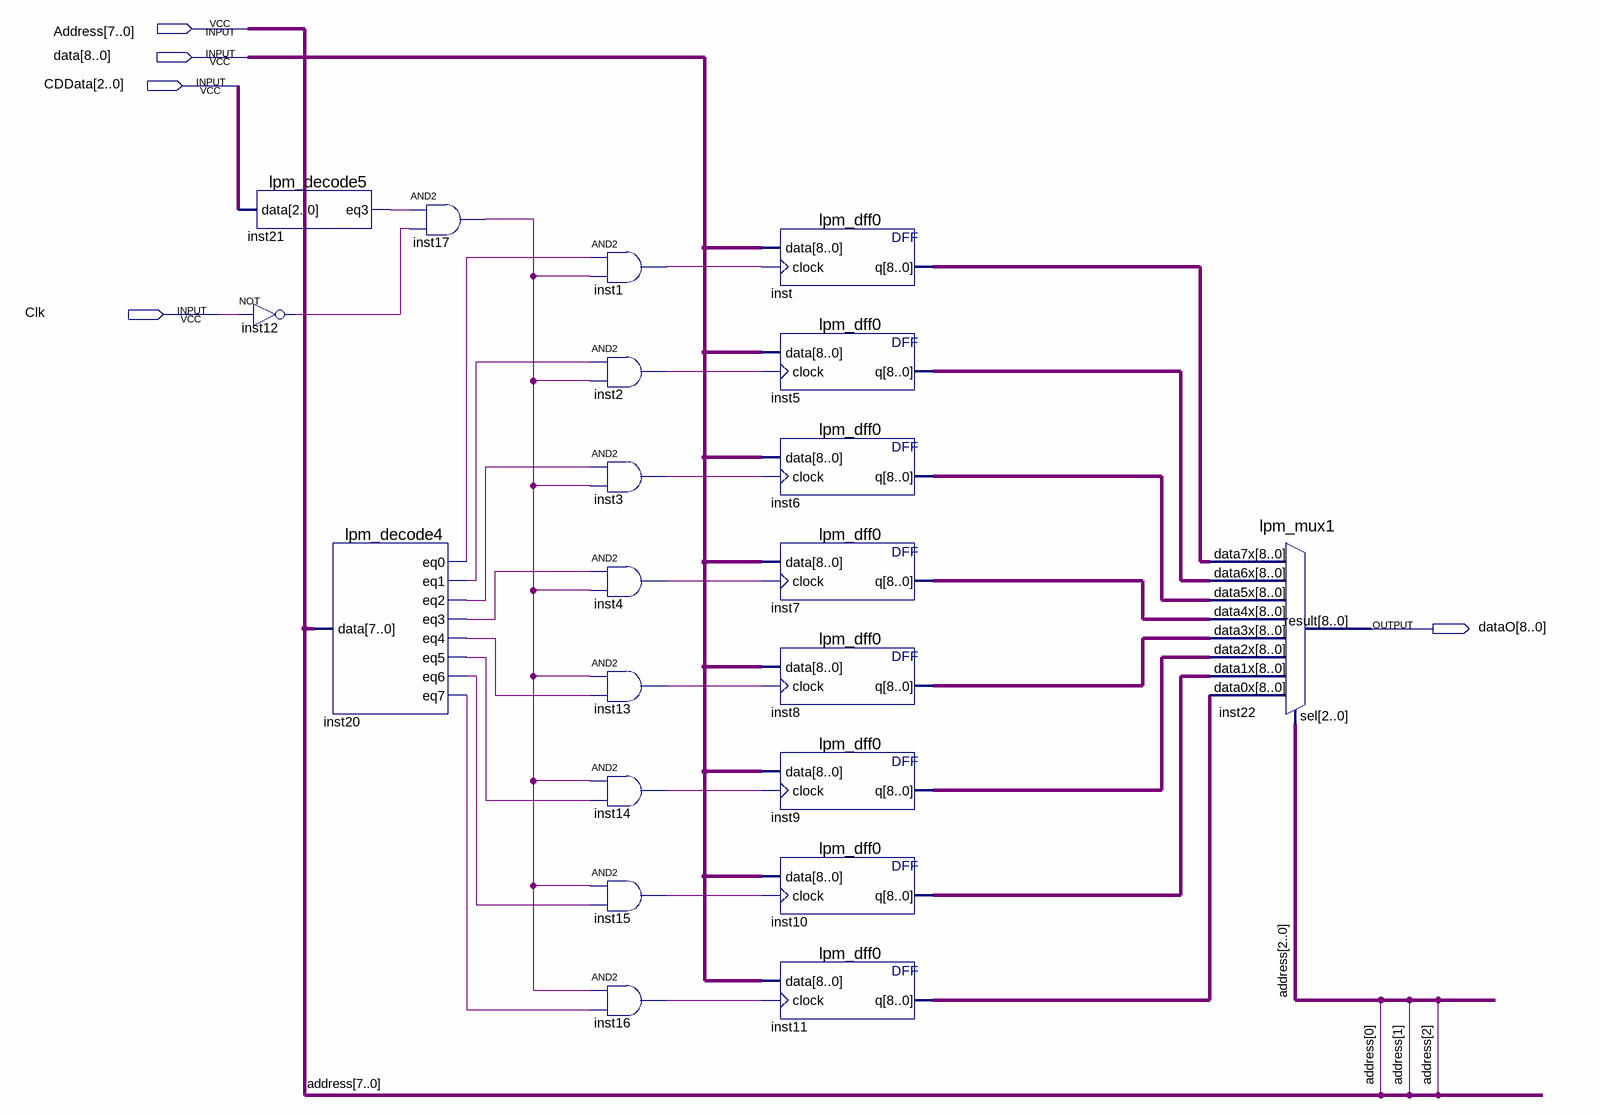
[diagram p0: schematic sheet]
// Quartus schematic RON.bdf as structural Verilog: 21 symbols, 5 pins
module RON (
  input  [7:0] Address,
  input  [8:0] data,
  input  [2:0] CDData,
  input  Clk,
  output [8:0] dataO
);

  wire inst1_out, inst2_out, inst3_out, inst4_out, inst12_out, inst13_out, inst14_out, inst15_out,
       inst16_out, inst17_out, inst20_eq0, inst20_eq1, inst20_eq2, inst20_eq3, inst20_eq4, inst20_eq5,
       inst20_eq6, inst20_eq7, inst21_eq3;
  wire [8:0] inst5_q, inst6_q, inst7_q, inst8_q, inst9_q, inst10_q, inst11_q, inst_q;

  lpm_decode5 inst21 (.data(CDData), .eq3(inst21_eq3));
  not inst12 (inst12_out, Clk);
  lpm_decode4 inst20 (
    .data(Address), .eq0(inst20_eq0), .eq1(inst20_eq1), .eq2(inst20_eq2), .eq3(inst20_eq3), .eq4(inst20_eq4),
    .eq5(inst20_eq5), .eq6(inst20_eq6), .eq7(inst20_eq7));
  and inst17 (inst17_out, inst21_eq3, inst12_out);
  and inst1 (inst1_out, inst20_eq0, inst17_out);
  and inst2 (inst2_out, inst20_eq1, inst17_out);
  and inst3 (inst3_out, inst20_eq2, inst17_out);
  and inst4 (inst4_out, inst20_eq3, inst17_out);
  and inst13 (inst13_out, inst17_out, inst20_eq4);
  and inst14 (inst14_out, inst17_out, inst20_eq5);
  and inst15 (inst15_out, inst17_out, inst20_eq6);
  and inst16 (inst16_out, inst17_out, inst20_eq7);
  lpm_dff0 inst (.data(data), .clock(inst1_out), .q(inst_q));
  lpm_dff0 inst5 (.data(data), .clock(inst2_out), .q(inst5_q));
  lpm_dff0 inst6 (.data(data), .clock(inst3_out), .q(inst6_q));
  lpm_dff0 inst7 (.data(data), .clock(inst4_out), .q(inst7_q));
  lpm_dff0 inst8 (.data(data), .clock(inst13_out), .q(inst8_q));
  lpm_dff0 inst9 (.data(data), .clock(inst14_out), .q(inst9_q));
  lpm_dff0 inst10 (.data(data), .clock(inst15_out), .q(inst10_q));
  lpm_dff0 inst11 (.data(data), .clock(inst16_out), .q(inst11_q));
  lpm_mux1 inst22 (
    .data7x(inst_q), .data6x(inst5_q), .data5x(inst6_q), .data4x(inst7_q), .data3x(inst8_q),
    .data2x(inst9_q), .data1x(inst10_q), .data0x(inst11_q), .sel(Address[2:0]), .result(dataO));
endmodule
